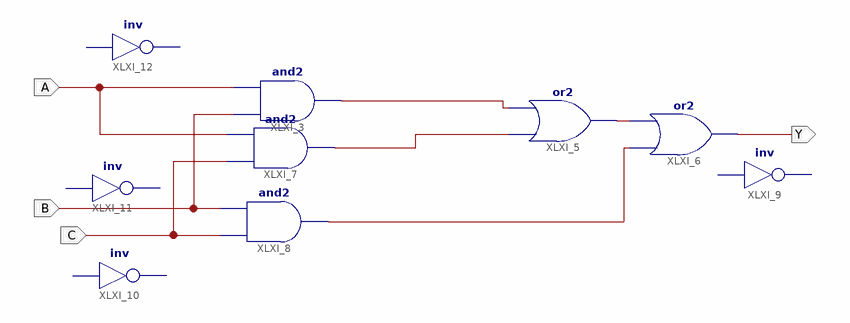
[diagram p0: schematic sheet 1]
// Xilinx ISE schematic MAJORITY.sch (spartan6) as structural Verilog: 9 symbols, 4 ports
module MAJORITY (
  input  A,
  input  C,
  input  B,
  output Y
);

  wire XLXN_3, XLXN_11, XLXN_12, XLXN_13;

  and XLXI_3 (XLXN_11, B, A);
  or XLXI_5 (XLXN_3, XLXN_13, XLXN_11);
  or XLXI_6 (Y, XLXN_12, XLXN_3);
  and XLXI_7 (XLXN_13, C, A);
  and XLXI_8 (XLXN_12, C, B);
  // inv XLXI_9 is placed but not wired
  // inv XLXI_10 is placed but not wired
  // inv XLXI_11 is placed but not wired
  // inv XLXI_12 is placed but not wired
endmodule
